# EAGLE design blink1mk3_card (EAGLE 9.0.1)
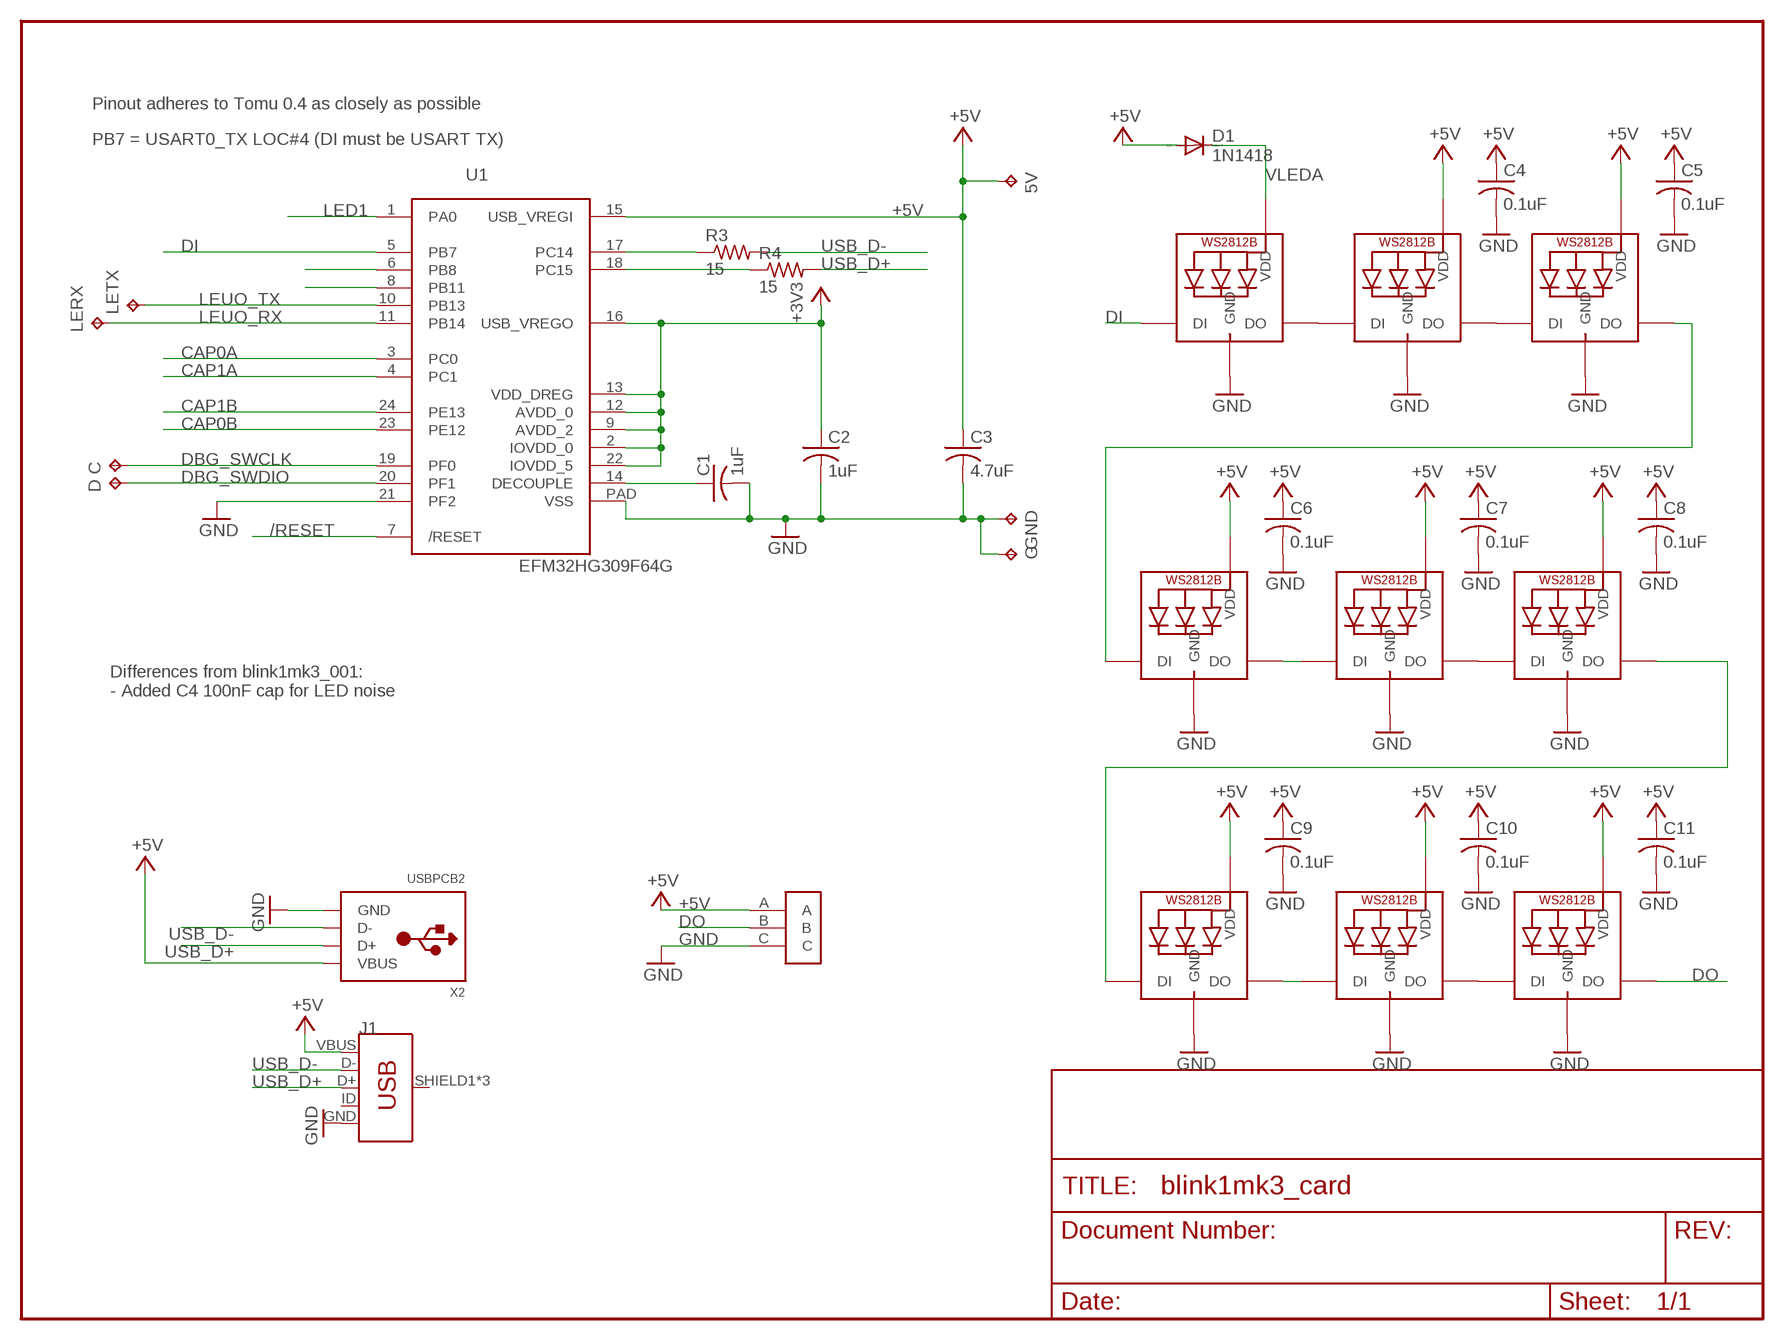
[diagram p0: schematic, sheet 1]

## Parts
5V  TPTP15R  [TP15R]
C  TPTP15R  [TP15R]
C1  1uF  C-USC0603  [C0603]
C2  1uF  C-USC0603  [C0603]
C3  4.7uF  C-USC0603  [C0603]
C4  0.1uF  C-USC0603  [C0603]
C5  0.1uF  C-USC0603  [C0603]
C6  0.1uF  C-USC0603  [C0603]
C7  0.1uF  C-USC0603  [C0603]
C8  0.1uF  C-USC0603  [C0603]
C9  0.1uF  C-USC0603  [C0603]
C10  0.1uF  C-USC0603  [C0603]
C11  0.1uF  C-USC0603  [C0603]
D  TPTP15R  [TP15R]
D1  1N1418  DIODE-SOD523  [SOD523]
G  TPTP14SQ  [TP14SQ]
GND  TPTP14SQ  [TP14SQ]
J1  USB_MICRO-B_FEMALE-SMT  [USB-B-MICRO-SMD]
LED1  WS2812B3535  [LED3535]
LED2  WS2812B3535  [LED3535]
LED3  WS2812B3535  [LED3535]
LED4  WS2812B3535  [LED3535]
LED5  WS2812B3535  [LED3535]
LED6  WS2812B3535  [LED3535]
LED7  WS2812B3535  [LED3535]
LED8  WS2812B3535  [LED3535]
LED9  WS2812B3535  [LED3535]
LERX  TPTP15R  [TP15R]
LETX  TPTP15R  [TP15R]
R3  15  R-US_R0603  [R0603]
R4  15  R-US_R0603  [R0603]
U1  EFM32HG309F64G  [QFN24PAD]
U$1  LED_STRIP_3P  [LEDSTRIP-3P]
X2  USBPCB2  [USB-A-PCB-2]

## Nets
+3V3: C2.1 U1.2(IOVDD_0) U1.9(AVDD_2) U1.12(AVDD_0) U1.13(VDD_DREG) U1.16(USB_VREGO) U1.22(IOVDD_5)
+5V: 5V.TP C3.1 C4.1 C5.1 C6.1 C7.1 C8.1 C9.1 C10.1 C11.1 D1.A J1.VBUS LED2.2(VDD) LED3.2(VDD) LED4.2(VDD) LED5.2(VDD) LED6.2(VDD) LED7.2(VDD) LED8.2(VDD) LED9.2(VDD) U1.15(USB_VREGI) U$1.A X2.5V(VBUS)
/RESET: U1.7(/RESET)
CAP0A: U1.3(PC0)
CAP0B: U1.23(PE12)
CAP1A: U1.4(PC1)
CAP1B: U1.24(PE13)
DBG_SWCLK: C.TP U1.19(PF0)
DBG_SWDIO: D.TP U1.20(PF1)
DECOUPLE: C1.1 U1.14(DECOUPLE)
DI: LED1.1(DI) U1.5(PB7)
DO: LED9.3(DO) U$1.B
GND: C1.2 C2.2 C3.2 C4.2 C5.2 C6.2 C7.2 C8.2 C9.2 C10.2 C11.2 G.TP GND.TP J1.GND LED1.4(GND) LED2.4(GND) LED3.4(GND) LED4.4(GND) LED5.4(GND) LED6.4(GND) LED7.4(GND) LED8.4(GND) LED9.4(GND) U1.21(PF2) U1.PAD(VSS) U$1.C X2.GND
LED1: U1.1(PA0)
LEUO_RX: LERX.TP U1.11(PB14)
LEUO_TX: LETX.TP U1.10(PB13)
N$1: U1.8(PB11)
N$2: LED1.3(DO) LED2.1(DI)
N$3: U1.6(PB8)
N$4: LED7.3(DO) LED8.1(DI)
N$5: LED4.3(DO) LED5.1(DI)
N$6: LED5.3(DO) LED6.1(DI)
N$7: LED2.3(DO) LED3.1(DI)
N$8: LED3.3(DO) LED4.1(DI)
N$9: LED8.3(DO) LED9.1(DI)
N$10: LED6.3(DO) LED7.1(DI)
RUSB_D+: R4.1 U1.18(PC15)
RUSB_D-: R3.1 U1.17(PC14)
USB_D+: J1.D+ R4.2 X2.USB_P(D+)
USB_D-: J1.D- R3.2 X2.USB_M(D-)
VLEDA: D1.C LED1.2(VDD)
Unconnected: J1.ID J1.SHIELD1(SHIELD) J1.SHIELD2(SHIELD) J1.SHIELD3(SHIELD)

## Notes on the sheet
- Pinout adheres to Tomu 0.4 as closely as possible
- PB7 = USART0_TX LOC#4 (DI must be USART TX)
- Differences from blink1mk3_001:
  - Added C4 100nF cap for LED noise

## Library data of the parts
5V C D G GND LERX LETX = testpad:TP: Test pad
C1-C11 = adafruit:C-US: CAPACITOR, American symbol
D1 = diode:DIODE-: DIODE
J1 = SparkFun-Connectors:USB_MICRO-B: USB Type Micro-B Connector Male/female and PTH/SMT variants SparkFun Products: SparkFun microB USB Breakout <https://www.sparkfun.com/products/12035> SparkFun USB microB Plug Breakout <https://www.sparkfun.com/products/10031> SparkFun ESP8266 Thing <https://www.sparkfun.com/products/13231>; PROD_ID: CONN-11752
LED1-LED9 = adafruit:WS2812B
R3 R4 = adafruit:R-US_: RESISTOR, American symbol
U1 = todstuff:EFM32HG309F64G
U$1 = NeoJoints:LED_STRIP_3P: NeoJoint pads for WS2812 / NeoPixel LED strips
X2 = todstuff:USB

## Board
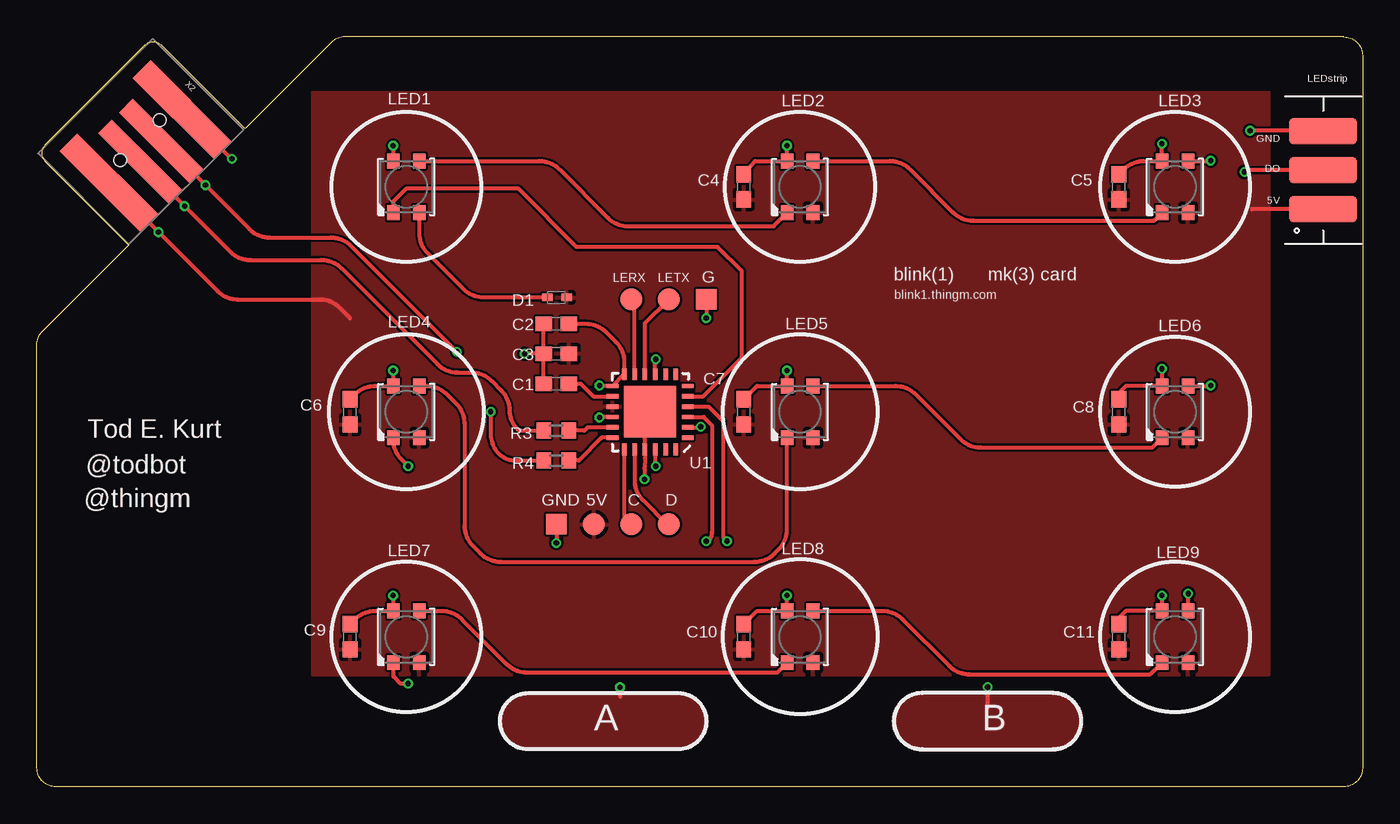
[diagram p1: board, top side]
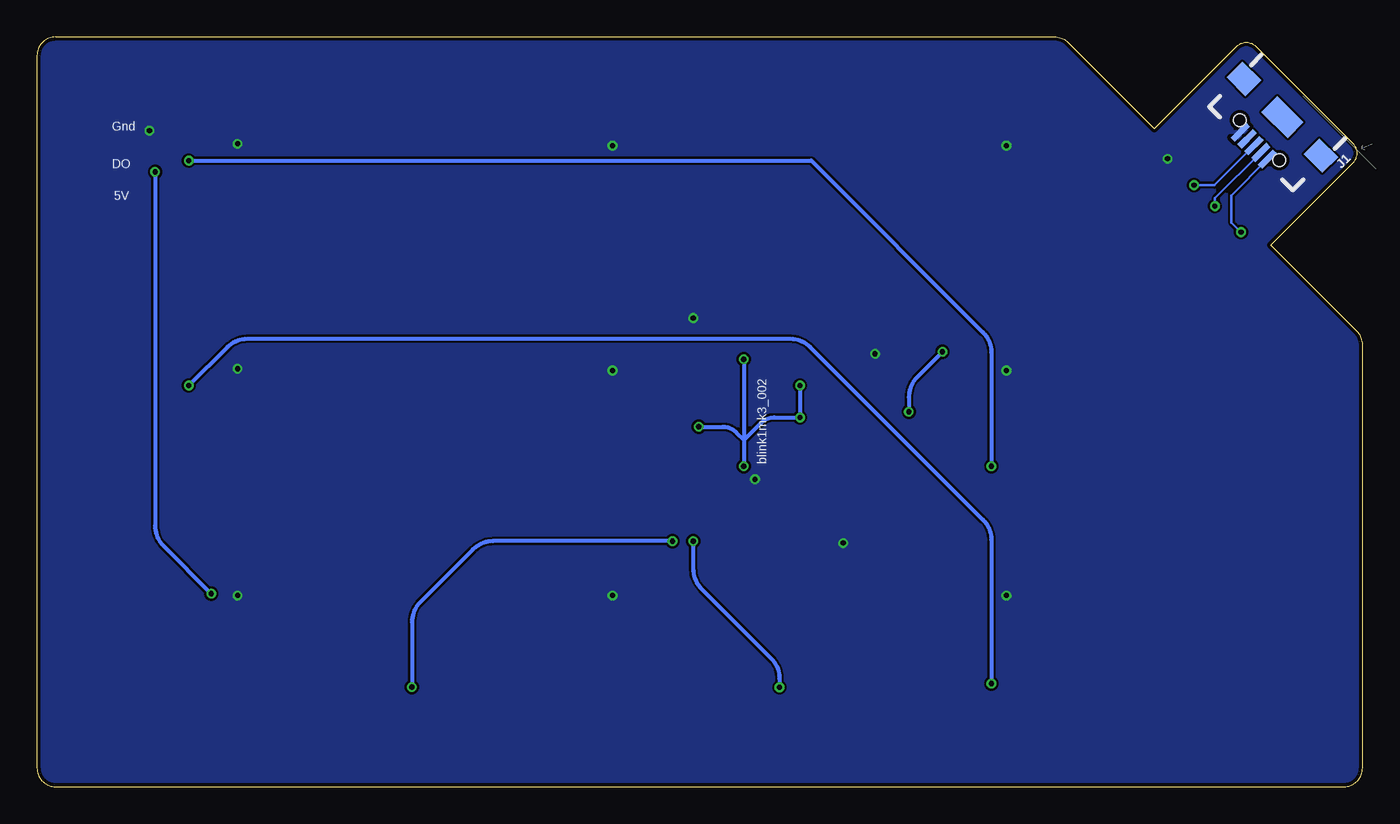
[diagram p2: board, bottom side, seen from below]

Size 89.79 x 50.8 mm. Coordinates in mm from the lower left corner, seen from the top.
Outline: 88.52,50.8 20.85,50.8 arc45 19.95,50.43 14.1,44.58 8.5,50.17 arc90 7.24,50.17 0.63,43.55 arc90 0.63,42.3 6.22,36.7 0.37,30.85 arc45 0,29.95 0,1.27 arc90 1.27,0 88.52,0 arc90 89.79,1.27 89.79,49.53 arc90 88.52,50.8
Copper layers (1*16): Top 0.035mm / dielectric 1.5mm / Bottom 0.035mm
Design rules "SeeedStudio_2layer_DRU_no_angle_20140221": minimum track width 6mil, minimum drill 12mil, track to track 6mil, track to pad 6mil, pad to pad 6mil, via to via 6mil, smd to smd 0mil, copper to edge 10mil, drill to drill 10mil, minimum pad ring 10mil, minimum via ring 6mil, stop-mask expansion 2mil, vias tented up to drill 100mil, thermal gap 10mil

### Footprints (pad centres in the part's own frame; a part is rotated, then mirrored left to right if it is on the bottom)
TP15R = smd 1.5 x 1.5: TP 0,0
C0603 = smd 1.1 x 1: 1 -0.85,0; 2 0.85,0
SOD523 = smd 0.7 x 0.5: A 0.7,0; C -0.6,0
TP14SQ = smd 1.4 x 1.4: TP 0,0
USB-B-MICRO-SMD = smd 1.45 x 0.4: D+ 2.725,0; D- 2.725,0.65; GND 2.725,-1.3; ID 2.725,-0.65; VBUS 2.725,1.3 | smd 1.5 x 1.8: SHIELD1 0,3.685; SHIELD2 0,-3.685 | smd 1.5 x 2.5: SHIELD3 0,0 | hole 0.85: 2.2,1.9; 2.2,-1.9
LED3535 = smd 1 x 0.85: 1 -1.75,0.875; 2 -1.75,-0.875; 3 1.75,-0.875; 4 1.75,0.875
R0603 = smd 1 x 1.1: 1 -0.85,0; 2 0.85,0
QFN24PAD = smd 0.8 x 0.3: 1 -2.55,1.75; 2 -2.55,1.05; 3 -2.55,0.35; 4 -2.55,-0.35; 5 -2.55,-1.05; 6 -2.55,-1.75; 13 2.55,-1.75; 14 2.55,-1.05; 15 2.55,-0.35; 16 2.55,0.35; 17 2.55,1.05; 18 2.55,1.75 | smd 0.3 x 0.8: 7 -1.75,-2.55; 8 -1.05,-2.55; 9 -0.35,-2.55; 10 0.35,-2.55; 11 1.05,-2.55; 12 1.75,-2.55; 19 1.75,2.55; 20 1.05,2.55; 21 0.35,2.55; 22 -0.35,2.55; 23 -1.05,2.55; 24 -1.75,2.55 | smd 3.5 x 3.5: PAD 0,0
LEDSTRIP-3P = smd 4.6 x 1.8: A 0,-2.65; B 0,0; C 0,2.63
USB-A-PCB-2 = smd 7.75 x 1.69: 5V -1.47,-3.5; GND -1.47,3.5 | smd 6.75 x 1.3: USB_M -0.97,-1; USB_P -0.97,1

### Placement (x,y rotation side)
5V  37.72,17.78 0 top
C  40.26,17.78 0 top
C1  35.18,27.3 180 top
C2  35.18,31.37 180 top
C3  35.18,29.34 180 top
C4  47.88,40.64 90 top
C5  73.28,40.64 90 top
C6  21.21,25.4 90 top
C7  47.88,25.4 90 top
C8  73.28,25.4 90 top
C9  21.21,10.16 90 top
C10  47.88,10.16 90 top
C11  73.28,10.16 90 top
D  42.8,17.78 0 top
D1  35.18,33.15 0 top
G  45.34,33.02 0 top
GND  35.18,17.78 0 top
J1  5.43,45.36 225 bottom
LED1  25.02,40.64 90 top
LED2  51.69,40.64 90 top
LED3  77.09,40.64 90 top
LED4  25.02,25.4 90 top
LED5  51.69,25.4 90 top
LED6  77.09,25.4 90 top
LED7  25.02,10.16 90 top
LED8  51.69,10.16 90 top
LED9  77.09,10.16 90 top
LERX  40.26,33.02 0 top
LETX  42.8,33.02 180 top
R3  35.18,24.13 180 top
R4  35.18,22.1 180 top
U1  41.53,25.4 180 top
U$1  87.12,41.78 0 top
X2  8.4,42.36 315 top

### Tracks (layer width: path | path; a pad name or v marks a point on that pad's centre or on a via)
+3V3  (via drill 0.35)
  Top 0.254: C2.1 37.18,31.37 arc-45 38.53,30.81 39.22,30.12 arc-45 39.78,28.77 U1.12 U1.13 38.13,27.15 v38.1,27.18 | U1.16 38.13,25.05 v38.1,25.02 | U1.22 41.88,21.75 v41.91,21.72 | U1.9 41.88,28.92 v41.91,28.96 | U1.2 44.92,24.35 v44.96,24.38
  Bottom 0.254: 41.91,23.49 40.76,24.65 arc45 39.86,25.02 v38.1,25.02 v38.1,27.18 | 41.91,23.49 v41.91,21.72 | v41.91,28.96 41.91,23.49 | v44.96,24.38 43.32,24.38 arc45 42.43,24.01 41.91,23.49
+5V  (via drill 0.35)
  Top 0.254: X2.5V v8.23,37.57 12.23,33.58 arc45 13.58,33.02 19.15,33.02 arc-45 20.5,32.46 21.21,31.75 | U$1.A 82.31,39.13 82.3,39.12
  Bottom 0.152: J1.VBUS 8.89,40.06 8.89,38.23 | 8.89,38.23 | 8.89,38.23 v8.23,37.57
  pour Top: 18.67,7.62 83.44,7.62 83.44,46.99 18.67,46.99
CAP0A  (via drill 0.35)
  Top 0.254: v45.34,16.64 45.47,16.64 arc45 45.72,17.25 45.72,24.48 45.15,25.05 U1.3 | v39.5,6.73 39.5,6.1
  Bottom 0.254: v45.34,16.64 45.34,14.76 arc-45 44.78,13.41 40.05,8.69 arc45 39.5,7.34 v39.5,6.73
  pour Top: 33.27,6.35 43.43,6.35 arc-90 45.34,4.45 arc-90 43.43,2.54 33.27,2.54 arc-90 31.37,4.45 arc-90
CAP1A  (via drill 0.35)
  Top 0.254: U1.4 45.5,25.75 46.48,24.76 46.48,16.89 v46.74,16.64 | v64.39,6.75 64.39,5.33
  Bottom 0.254: v46.74,16.64 58.9,16.64 arc-45 60.25,16.08 63.83,12.5 arc-45 64.39,11.15 v64.39,6.75
  pour Top: 59.94,6.35 68.83,6.35 arc-90 70.74,4.45 arc-90 68.83,2.54 59.94,2.54 arc-90 58.04,4.45 arc-90
DBG_SWCLK
  Top 0.254: C.TP 39.78,18.26 U1.19
DBG_SWDIO
  Top 0.254: U1.20 40.48,20.76 arc45 41.04,19.41 42.67,17.78 D.TP
DECOUPLE
  Top 0.254: C1.1 36.83,27.3 37.69,26.45 U1.14
DI
  Top 0.254: LED1.1 24.14,39.61 24.13,39.62 25.02,40.51 32.61,40.51 36.55,36.58 46.1,36.58 47.75,34.92 47.75,29.08 45.12,26.45 U1.5
DO  (via drill 0.35)
  Top 0.254: v77.98,13.08 77.96,13.07 LED9.3 | U$1.B 81.91,41.78 arc90 v81.79,41.66
  Bottom 0.254: v81.79,41.66 81.79,17.68 arc-45 81.23,16.33 v77.98,13.08
GND  (via drill 0.35)
  Top 0.254: X2.GND 13.08,42.62 v13.21,42.55 | LED1.4 24.14,43.42 v24.13,43.43 | C6.2 21.55,26.59 arc-45 22.9,27.15 LED4.4 24.14,28.18 v24.13,28.19 | C4.2 48.65,42.39 LED2.4 50.81,43.42 v50.8,43.43 | C5.2 73.62,41.83 arc-45 74.97,42.39 LED3.4 76.2,42.4 v76.2,43.56 | v76.2,28.32 76.21,28.31 LED6.4 73.76,27.15 73.28,26.67 C8.2 | C7.2 48.78,27.15 LED5.4 50.81,28.18 v50.8,28.19 | C10.2 48.78,11.91 LED8.4 50.81,12.94 v50.8,12.95 | v76.2,12.95 76.21,12.94 LED9.4 73.76,11.91 73.28,11.43 C11.2 | v24.13,12.95 24.14,12.94 LED7.4 22.9,11.91 arc45 21.55,11.35 C9.2 | C1.2 C3.2 | C3.2 C2.2 | C3.2 v33.02,29.34 | U1.PAD 41.53,24.64 41.18,24.29 U1.21 41.18,22.26 41.15,21.59 v41.15,20.83 | GND.TP v35.18,16.51 | U$1.C arc90 87.09,44.45 v82.17,44.45 | G.TP v45.34,31.75
  pour Bottom: 89.79,50.8 -0.38,50.8 -0.38,0 89.79,0
LEUO_RX
  Top 0.254: U1.11 40.48,32.8 LERX.TP
LEUO_TX
  Top 0.254: U1.10 41.18,31.4 LETX.TP
N$2
  Top 0.254: LED1.3 34.04,42.39 arc-45 35.38,41.83 38.69,38.53 arc45 40.03,37.97 49.9,37.97 LED2.1
N$4
  Top 0.254: LED7.3 27.43,11.91 arc-45 28.78,11.35 31.83,8.3 arc45 33.17,7.75 50.15,7.75 LED8.1
N$5
  Top 0.254: LED4.3 26.42,27.15 arc-45 27.76,26.59 28.4,25.96 arc-45 28.96,24.61 28.96,17.68 arc45 29.51,16.33 30.05,15.8 arc45 31.4,15.24 48.61,15.24 arc45 49.96,15.8 50.24,16.08 arc45 50.8,17.43 50.8,23.64 LED5.1
N$6
  Top 0.254: LED5.3 58.17,27.15 arc-45 59.51,26.59 62.56,23.54 arc45 63.91,22.99 75.55,22.99 LED6.1
N$7
  Top 0.254: LED2.3 57.79,42.39 arc-45 59.13,41.83 62.05,38.91 arc45 63.4,38.35 75.68,38.35 LED3.1
N$8  (via drill 0.35)
  Top 0.254: 78.06,42.29 LED3.3 79.5,42.39 v79.5,42.42 | v25.15,21.72 24.7,22.16 arc-45 24.14,23.51 LED4.1
  Bottom 0.254: v79.5,42.42 37.34,42.42 25.7,30.78 arc45 25.15,29.44 v25.15,21.72
N$9
  Top 0.254: LED8.3 57.28,11.91 arc-45 58.62,11.35 61.8,8.18 arc45 63.15,7.62 75.42,7.62 LED9.1
N$10  (via drill 0.35)
  Top 0.254: LED6.3 79.47,27.15 v79.5,27.18 | v25.15,6.98 24.64,6.98 24.14,7.48 LED7.1
  Bottom 0.254: v25.15,6.98 25.15,16.74 arc-45 25.7,18.08 37.41,29.79 arc-45 38.76,30.35 75.54,30.35 arc-45 76.88,29.79 v79.5,27.18
RUSB_D+
  Top 0.254: U1.18 38.25,23.65 36.7,22.1 R4.1
RUSB_D-
  Top 0.254: U1.17 37.3,24.35 37.08,24.13 R3.1
USB_D+  (via drill 0.35)
  Top 0.254: X2.USB_P v11.42,40.75 14.4,37.77 arc45 15.75,37.21 19.91,37.21 arc-45 21.26,36.65 v28.45,29.46 | v30.73,25.4 30.73,23.9 arc45 31.29,22.56 arc45 32.4,22.1 R4.2
  Bottom 0.152: J1.D+ 10.04,40.75 v11.42,40.75
  Bottom 0.254: v28.45,29.46 30.18,27.74 arc-45 30.73,26.39 v30.73,25.4
USB_D-  (via drill 0.35)
  Top 0.254: X2.USB_M v10,39.34 13.1,36.24 arc45 14.44,35.69 19.28,35.69 arc-45 20.62,35.13 27.13,28.62 arc45 28.47,28.07 29.44,28.07 arc-45 30.78,27.51 31.45,26.85 arc-45 32,25.5 arc45 32.52,24.24 arc45 32.8,24.13 R3.2
  Bottom 0.152: J1.D- 10,39.87 v10,39.34
VLEDA
  Top 0.254: D1.C 30.25,33.15 arc-45 28.91,33.7 26.47,36.14 arc-45 25.91,37.49 25.91,38.88 LED1.2

### Text on the board
tPlace: LEDstrip | GND | DO | 5V | blink(1) | mk(3) card | blink1.thingm.com | Tod E. Kurt | @todbot | @thingm | A | B
bPlace: Gnd | DO | 5V | blink1mk3_002